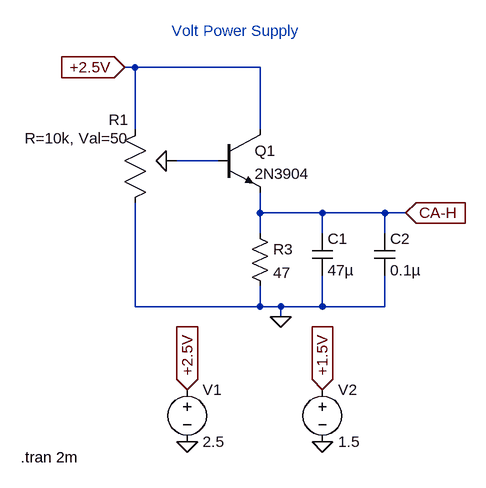
[diagram p0: schematic volt_power_supply_ltspice.asc]
volt_power_supply_ltspice.asc, the LTspice schematic file:
Version 4
SHEET 1 880 792
WIRE 176 176 160 176
WIRE 368 176 176 176
WIRE 176 272 176 176
WIRE 368 272 368 176
WIRE 304 320 240 320
WIRE 368 400 368 368
WIRE 464 400 368 400
WIRE 560 400 464 400
WIRE 592 400 560 400
WIRE 368 432 368 400
WIRE 464 432 464 400
WIRE 560 432 560 400
WIRE 176 544 176 384
WIRE 368 544 368 512
WIRE 368 544 176 544
WIRE 400 544 368 544
WIRE 464 544 464 496
WIRE 464 544 400 544
WIRE 560 544 560 496
WIRE 560 544 464 544
WIRE 400 560 400 544
FLAG 160 176 +2.5V
IOPIN 160 176 In
FLAG 592 400 CA-H
IOPIN 592 400 In
FLAG 400 560 0
FLAG 256 672 +2.5V
IOPIN 256 672 In
FLAG 464 672 +1.5V
IOPIN 464 672 In
FLAG 256 752 0
FLAG 464 752 0
SYMBOL npn 304 272 R0
SYMATTR InstName Q1
SYMATTR Value 2N3904
SYMBOL potentiometer 192 288 M0
WINDOW 39 26 -3 Left 2
SYMATTR SpiceLine R=10k, Val=50
SYMATTR InstName R1
SYMBOL res 352 416 R0
SYMATTR InstName R3
SYMATTR Value 47
SYMBOL cap 448 432 R0
SYMATTR InstName C1
SYMATTR Value 47µ
SYMBOL cap 544 432 R0
SYMATTR InstName C2
SYMATTR Value 0.1µ
SYMBOL voltage 256 656 R0
SYMATTR InstName V1
SYMATTR Value 2.5
SYMBOL voltage 464 656 R0
SYMATTR InstName V2
SYMATTR Value 1.5
TEXT 232 120 Left 2 ;Volt Power Supply
TEXT 0 776 Left 2 !.tran 2m

The netlist it stands for:
* volt_power_supply_ltspice.asc
Q1 +2.5V N001 CA-H 0 2N3904
XR1 +2.5V N001 0 potentiometer R=10k, Val=50  ; pins 1 2 3
R3 CA-H 0 47
C1 CA-H 0 47µ
C2 CA-H 0 0.1µ
V1 +2.5V 0 2.5
V2 +1.5V 0 1.5
.model NPN NPN
.model PNP PNP
.lib standard.bjt
* Volt Power Supply
.tran 2m
.backanno
.end